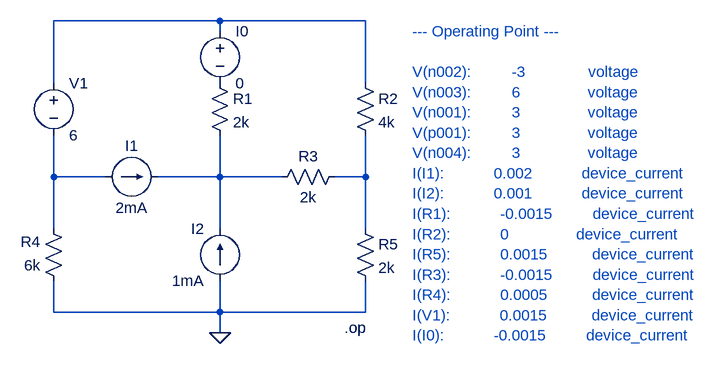
[diagram p0: schematic Q3.asc]
Q3.asc, the LTspice schematic file:
Version 4
SHEET 1 948 680
WIRE 176 -80 -80 -80
WIRE 400 -80 176 -80
WIRE 176 -64 176 -80
WIRE -80 16 -80 -80
WIRE 400 16 400 -80
WIRE -80 160 -80 96
WIRE 0 160 -80 160
WIRE 176 160 176 96
WIRE 176 160 80 160
WIRE 272 160 176 160
WIRE 400 160 400 96
WIRE 400 160 352 160
WIRE -80 240 -80 160
WIRE 176 240 176 160
WIRE 400 240 400 160
WIRE -80 368 -80 320
WIRE 176 368 176 320
WIRE 176 368 -80 368
WIRE 400 368 400 320
WIRE 400 368 176 368
WIRE 176 400 176 368
FLAG 176 400 0
SYMBOL current 0 160 R270
WINDOW 0 32 40 VTop 2
WINDOW 3 -32 40 VBottom 2
SYMATTR InstName I1
SYMATTR Value 2mA
SYMBOL current 176 320 R180
WINDOW 0 24 80 Left 2
WINDOW 3 24 0 Left 2
SYMATTR InstName I2
SYMATTR Value 1mA
SYMBOL voltage -80 0 R0
SYMATTR InstName V1
SYMATTR Value 6
SYMBOL res 160 0 R0
SYMATTR InstName R1
SYMATTR Value 2k
SYMBOL res 384 0 R0
SYMATTR InstName R2
SYMATTR Value 4k
SYMBOL res 384 224 R0
SYMATTR InstName R5
SYMATTR Value 2k
SYMBOL res 368 144 R90
WINDOW 0 0 56 VBottom 2
WINDOW 3 32 56 VTop 2
SYMATTR InstName R3
SYMATTR Value 2k
SYMBOL res -64 336 R180
WINDOW 0 36 76 Left 2
WINDOW 3 36 40 Left 2
SYMATTR InstName R4
SYMATTR Value 6k
SYMBOL voltage 176 -80 R0
SYMATTR InstName I0
SYMATTR Value 0
TEXT 368 392 Left 2 !.op
TEXT 472 -64 Left 2 ;--- Operating Point ---\n \nV(n002):         -3              voltage\nV(n003):         6               voltage\nV(n001):         3               voltage\nV(p001):         3               voltage\nV(n004):         3               voltage\nI(I1):           0.002           device_current\nI(I2):           0.001           device_current\nI(R1):           -0.0015         device_current\nI(R2):           0               device_current\nI(R5):           0.0015          device_current\nI(R3):           -0.0015         device_current\nI(R4):           0.0005          device_current\nI(V1):           0.0015          device_current\nI(I0):           -0.0015         device_current

The netlist it stands for:
* Q3.asc
I1 N002 N003 2mA
I2 0 N003 1mA
V1 N001 N002 6
R1 P001 N003 2k
R2 N001 N004 4k
R5 N004 0 2k
R3 N004 N003 2k
R4 0 N002 6k
V§I0 N001 P001 0
.op
* --- Operating Point ---
* V(n002):         -3              voltage
* V(n003):         6               voltage
* V(n001):         3               voltage
* V(p001):         3               voltage
* V(n004):         3               voltage
* I(I1):           0.002           device_current
* I(I2):           0.001           device_current
* I(R1):           -0.0015         device_current
* I(R2):           0               device_current
* I(R5):           0.0015          device_current
* I(R3):           -0.0015         device_current
* I(R4):           0.0005          device_current
* I(V1):           0.0015          device_current
* I(I0):           -0.0015         device_current
.backanno
.end